# EAGLE design smd_2 (EAGLE 7.6.0)
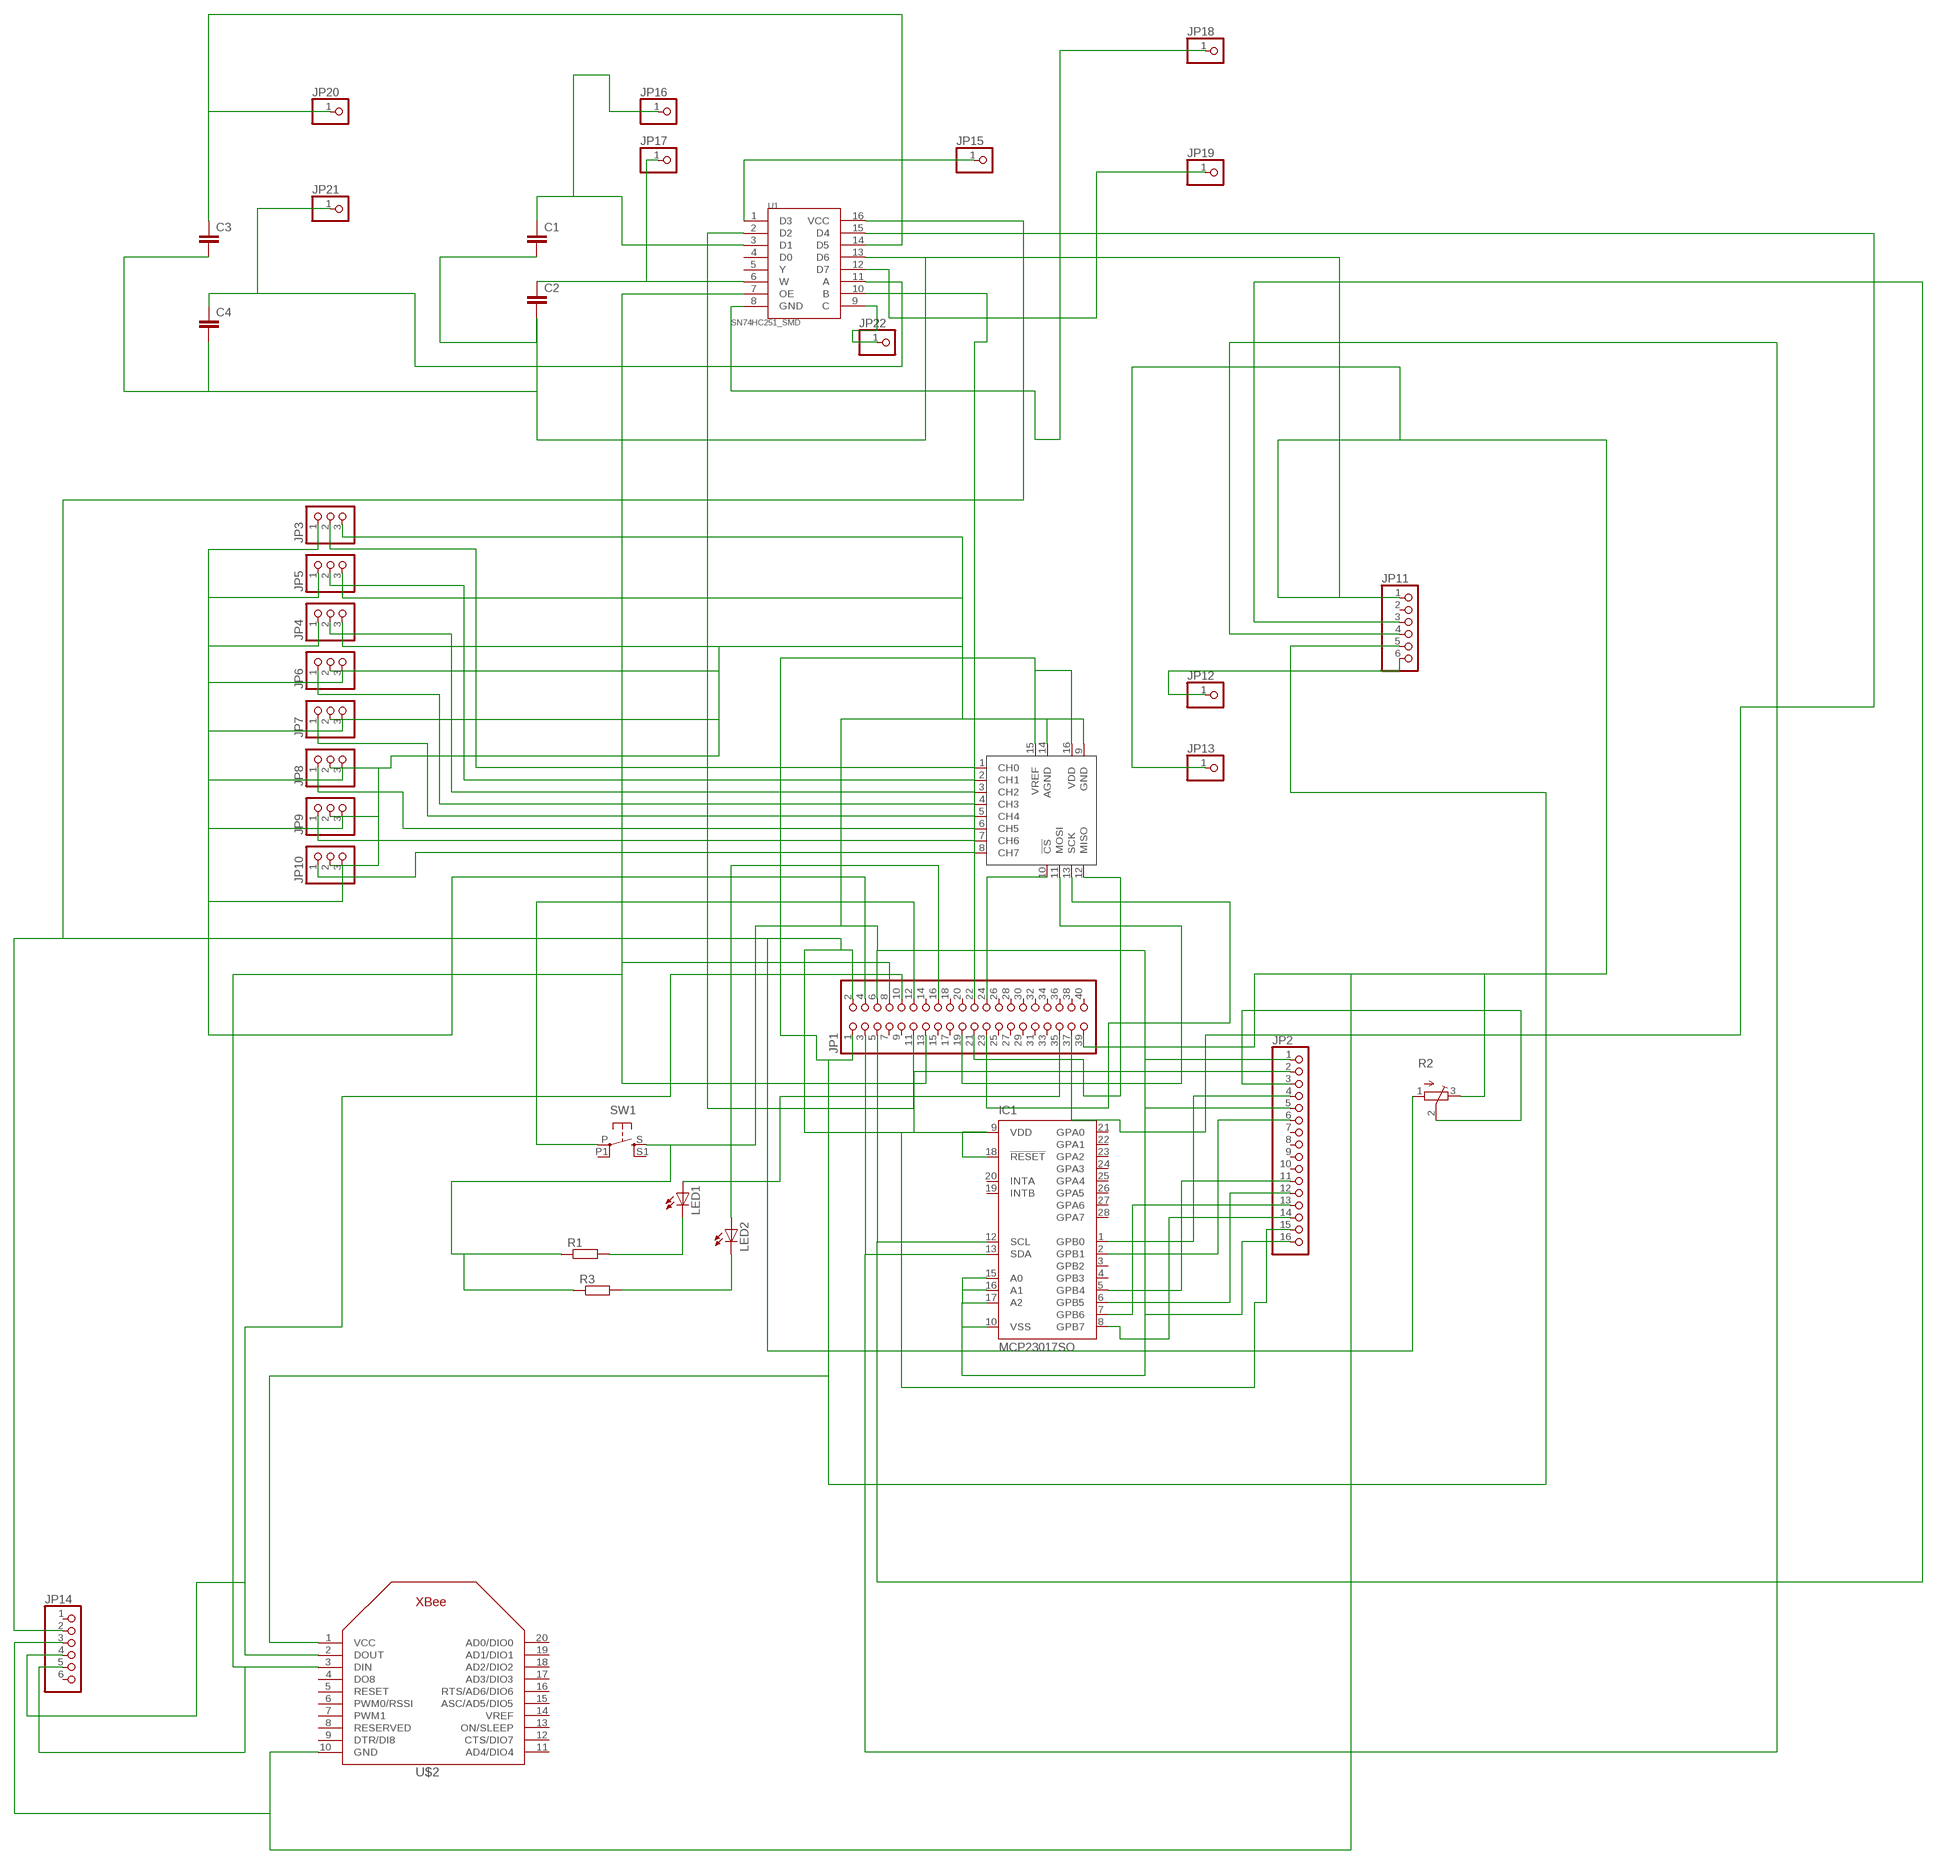
[diagram p0: schematic, sheet 1]

## Parts
C1  CAP1206  [1206]
C2  CAP1206  [1206]
C3  CAP1206  [1206]
C4  CAP1206  [1206]
IC1  MCP23017SO  [SO28W]
JP1  PINHD-2X20  [2X20]
JP2  PINHD-1X16  [1X16]
JP3  PINHD-1X3  [1X03]
JP4  PINHD-1X3  [1X03]
JP5  PINHD-1X3  [1X03]
JP6  PINHD-1X3  [1X03]
JP7  PINHD-1X3  [1X03]
JP8  PINHD-1X3  [1X03]
JP9  PINHD-1X3  [1X03]
JP10  PINHD-1X3  [1X03]
JP11  PINHD-1X6  [1X06]
JP12  PINHD-1X1  [1X01]
JP13  PINHD-1X1  [1X01]
JP14  PINHD-1X6  [1X06]
JP15  PINHD-1X1  [1X01]
JP16  PINHD-1X1  [1X01]
JP17  PINHD-1X1  [1X01]
JP18  PINHD-1X1  [1X01]
JP19  PINHD-1X1  [1X01]
JP20  PINHD-1X1  [1X01]
JP21  PINHD-1X1  [1X01]
JP22  PINHD-1X1  [1X01]
LED1  LEDSMT1206  [1206]
LED2  LEDCHIPLED_1206  [CHIPLED_1206]
R1  R-EU_M1206  [M1206]
R2  TRIM_EU-3223W  [3223W]
R3  R-EU_M1206  [M1206]
SW1  10-XX-4.5SMD  [BT4.5X4.5]
U1  SN74HC251_SMD  [SO016]
U$1  MCP3008SL  [SO16]
U$2  XBEE  [XBEE]

## Nets
GND: C1.2 C2.2 C3.2 C4.2 JP1.39 JP11.1 JP13.1 JP14.3 R2.3(E) U1.13(D6) U$2.10(GND)
N$1: IC1.10(VSS) IC1.15(A0) IC1.16(A1) IC1.17(A2) JP1.6 JP2.1 JP2.5 JP2.16 JP3.3 JP4.3 JP5.3 JP6.2 JP7.2 JP8.2 JP9.2 JP10.2 R1.1 R3.1 SW1.S U$1.9(GND) U$1.14(AGND)
N$2: IC1.9(VDD) IC1.18(!RESET) JP1.2 JP2.2 JP2.15 JP14.2 R2.1(A) U1.16(VCC)
N$3: JP1.12 SW1.P
N$4: IC1.12(SCL) JP1.5 JP11.3
N$5: IC1.13(SDA) JP1.3 JP11.4
N$6: IC1.1(GPB0) JP2.4
N$7: IC1.2(GPB1) JP2.6
N$8: LED1.C R1.2
N$9: JP1.35 LED1.A
N$10: IC1.8(GPB7) JP2.14
N$11: IC1.7(GPB6) JP2.13
N$12: IC1.6(GPB5) JP2.12
N$13: IC1.5(GPB4) JP2.11
N$14: JP1.10 JP14.4 U$2.2(DOUT)
N$15: JP1.24 U$1.10(!CS)
N$16: JP1.19 U$1.11(MOSI)
N$17: JP1.21 U$1.12(MISO)
N$18: JP1.23 U$1.13(SCK)
N$19: JP3.2 U$1.1(CH0)
N$20: JP5.2 U$1.2(CH1)
N$21: JP4.2 U$1.3(CH2)
N$22: JP6.1 U$1.4(CH3)
N$23: JP7.1 U$1.5(CH4)
N$24: JP8.1 U$1.6(CH5)
N$25: JP9.1 U$1.7(CH6)
N$26: JP10.1 U$1.8(CH7)
N$27: JP1.4 JP3.1 JP4.1 JP5.1 JP6.3 JP7.3 JP8.3 JP9.3 JP10.3
N$28: JP15.1 U1.1(D3)
N$29: JP11.6 JP12.1
N$30: JP1.8 JP14.5 U$2.3(DIN)
N$31: JP1.11 U1.2(D2)
N$32: JP1.13 U1.7(OE)
N$33: JP18.1 U1.8(GND)
N$34: C1.1 JP16.1 U1.3(D1)
N$35: C2.1 JP17.1 U1.6(W)
N$36: JP19.1 U1.12(D7)
N$37: JP2.3 R2.2(S)
N$38: JP1.16 LED2.A
N$39: LED2.C R3.2
N$40: C3.1 JP20.1 U1.14(D5)
N$41: C4.1 JP21.1 U1.11(A)
N$42: JP1.37 U1.15(D4)
N$43: JP1.22 U1.10(B)
N$44: JP22.1 U1.9(C)
VCC: JP1.1 JP11.5 U$1.15(VREF) U$1.16(VDD) U$2.1(VCC)
Unconnected: IC1.3(GPB2) IC1.4(GPB3) IC1.19(INTB) IC1.20(INTA) IC1.21(GPA0) IC1.22(GPA1) IC1.23(GPA2) IC1.24(GPA3) IC1.25(GPA4) IC1.26(GPA5) IC1.27(GPA6) IC1.28(GPA7) JP1.7 JP1.9 JP1.14 JP1.15 JP1.17 JP1.18 JP1.20 JP1.25 JP1.26 JP1.27 JP1.28 JP1.29 JP1.30 JP1.31 JP1.32 JP1.33 JP1.34 JP1.36 JP1.38 JP1.40 JP2.7 JP2.8 JP2.9 JP2.10 JP11.2 JP14.1 JP14.6 SW1.P1 SW1.S1 U1.4(D0) U1.5(Y) U$2.4(DO8) U$2.5(RESET) U$2.6(PWM0/RSSI) U$2.7(PWM1) U$2.8(RESERVED) U$2.9(DTR/DI8) U$2.11(AD4/DIO4) U$2.12(CTS/DIO7) U$2.13(ON/SLEEP) U$2.14(VREF) U$2.15(ASC/AD5/DIO5) U$2.16(RTS/AD6/DIO6) U$2.17(AD3/DIO3) U$2.18(AD2/DIO2) U$2.19(AD1/DIO1) U$2.20(AD0/DIO0)

## Library data of the parts
C1-C4 = SparkFun-Capacitors:CAP: Capacitor Standard 0603 ceramic capacitor, and 0.1" leaded capacitor.
IC1 = adafruit:MCP23017: http://ww1.microchip.com/downloads/en/DeviceDoc/21952a.pdf Source: http://ww1.microchip.com/downloads/en/DeviceDoc/21952a.pdf
JP1 = pinhead:PINHD-2X20: PIN HEADER
JP2 = pinhead:PINHD-1X16: PIN HEADER
JP3-JP10 = pinhead:PINHD-1X3: PIN HEADER
JP11 JP14 = pinhead:PINHD-1X6: PIN HEADER
JP12 JP13 JP15-JP22 = pinhead:PINHD-1X1: PIN HEADER
LED1 LED2 = led:LED: LED OSRAM: - CHIPLED LG R971, LG N971, LY N971, LG Q971, LY Q971, LO R971, LY R971 LH N974, LH R974 LS Q976, LO Q976, LY Q976 LO Q996 - Hyper CHIPLED LW Q18S LB Q993, LB Q99A, LB R99A - SideLED LS A670, LO A670, LY A670, LG A670, LP A670 LB A673, LV A673, LT A673, LW A673 LH A674 LY A675 LS A676, LA A676, LO A676, LY A676, LW A676 LS A679, LY A679, LG A679 - Hyper Micro SIDELED® LS Y876, LA Y876, LO Y876, LY Y876 LT Y87S - SmartLED LW L88C, LW L88S LB L89C, LB L89S, LG L890 LS L89K, LO L89K, LY L89K LS L896, LA L896, LO L896, LY L896 - TOPLED LS T670, LO T670, LY T670, LG T670, LP T670 LSG T670, LSP T670, LSY T670, LOP T670, LYG T670 LG T671, LOG T671, LSG T671 LB T673, LV T673, LT T673, LW T673 LH T674 LS T676, LA T676, LO T676, LY T676, LB T676, LH T676, LSB T676, LW T676 LB T67C, LV T67C, LT T67C, LS T67K, LO T67K, LY T67K, LW E67C LS E67B, LA E67B, LO E67B, LY E67B, LB E67C, LV E67C, LT E67C LW T67C LS T679, LY T679, LG T679 LS T770, LO T770, LY T770, LG T770, LP T770 LB T773, LV T773, LT T773, LW T773 LH T774 LS E675, LA E675, LY E675, LS T675 LS T776, LA T776, LO T776, LY T776, LB T776 LHGB T686 LT T68C, LB T68C - Hyper Mini TOPLED® LB M676 - Mini TOPLED Santana® LG M470 LS M47K, LO M47K, LY M47K Source: http://www.osram.convergy.de LUXEON: - LUMILED® LXK2-PW12-R00, LXK2-PW12-S00, LXK2-PW14-U00, LXK2-PW14-V00 LXK2-PM12-R00, LXK2-PM12-S00, LXK2-PM14-U00 LXK2-PE12-Q00, LXK2-PE12-R00, LXK2-PE12-S00, LXK2-PE14-T00, LXK2-PE14-U00 LXK2-PB12-K00, LXK2-PB12-L00, LXK2-PB12-M00, LXK2-PB14-N00, LXK2-PB14-P00, LXK2-PB14-Q00 LXK2-PR12-L00, LXK2-PR12-M00, LXK2-PR14-Q00, LXK2-PR14-R00 LXK2-PD12-Q00, LXK2-PD12-R00, LXK2-PD12-S00 LXK2-PH12-R00, LXK2-PH12-S00 LXK2-PL12-P00, LXK2-PL12-Q00, LXK2-PL12-R00 Source: www.luxeon.com KINGBRIGHT: KA-3528ASYC Source: www.kingbright.com
R1 R3 = resistor:R-EU_: RESISTOR, European symbol
R2 = pot:TRIM_EU-: POTENTIOMETER
SW1 = buttons:10-XX: OMRON SWITCH
U1 = SparkFun-DigitalIC:SN74HC251: SN54HC251 Data Selector/Multiplexer
U$1 = MCP3008:MCP3008
U$2 = adafruit:XBEE

## Board
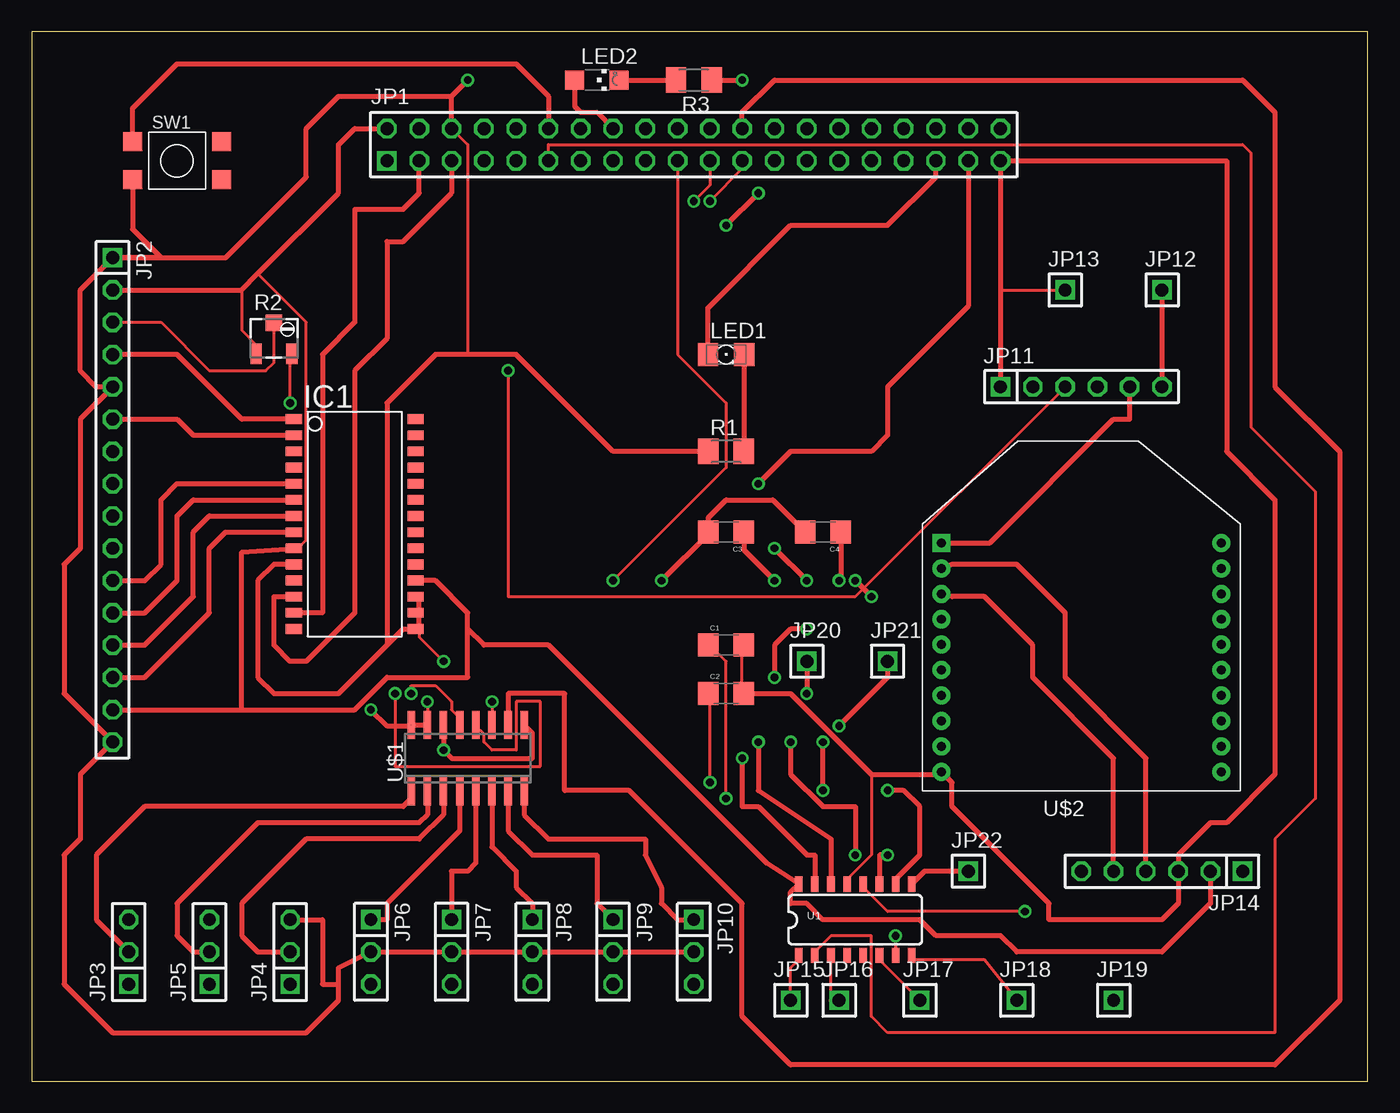
[diagram p1: board, top side]
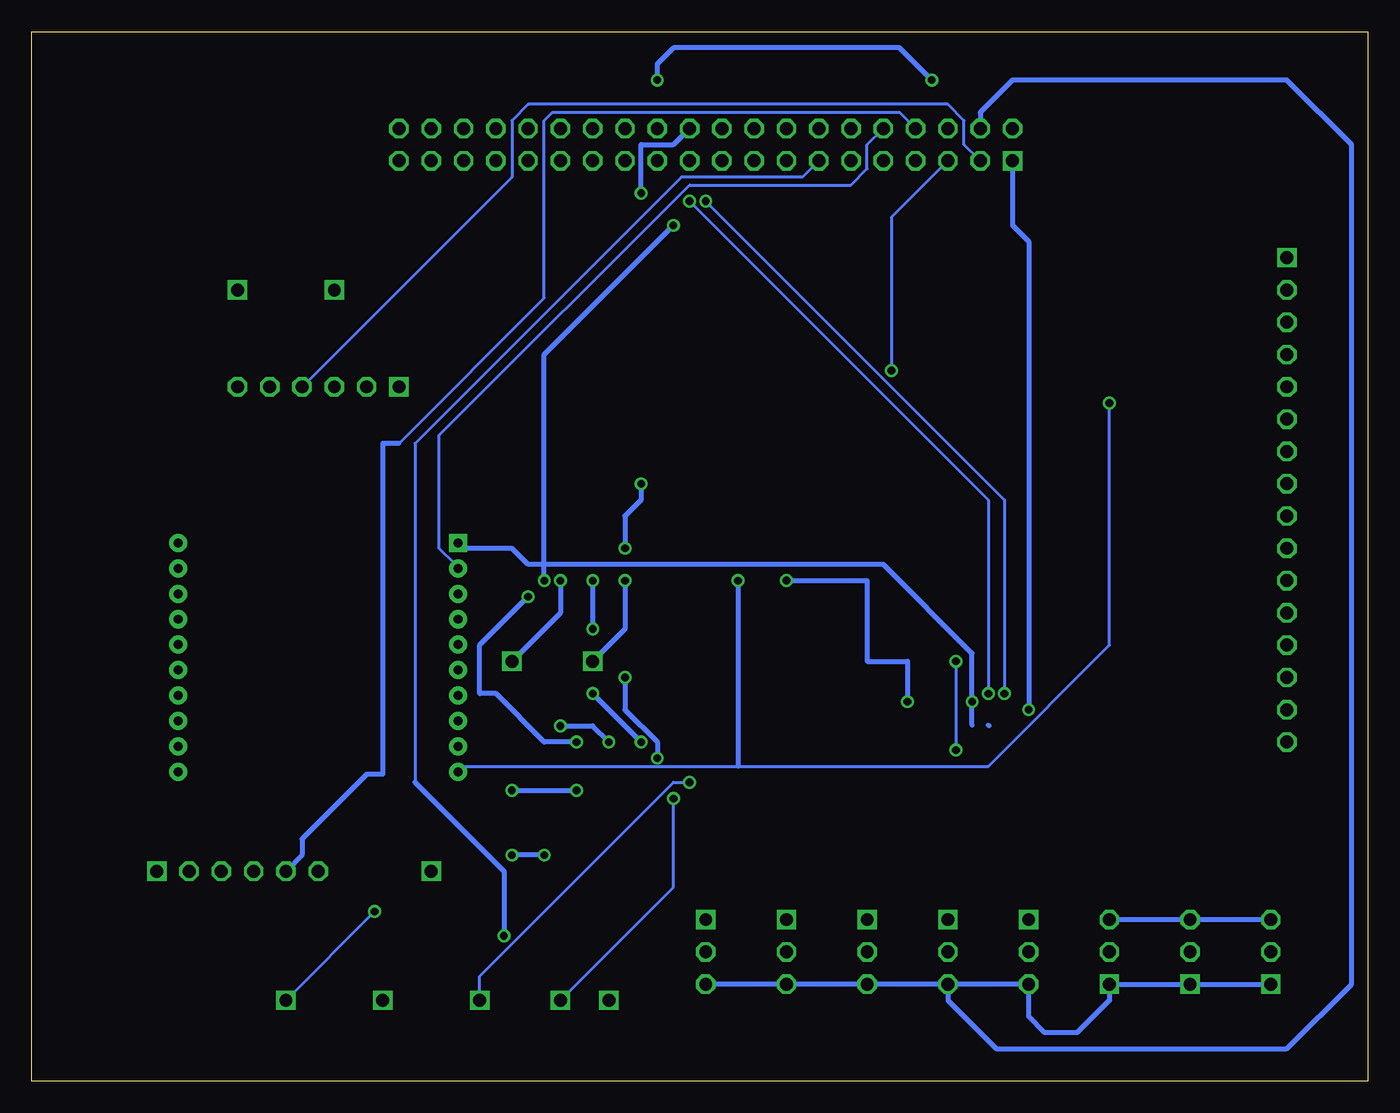
[diagram p2: board, bottom side, seen from below]

Size 105.08 x 82.54 mm. Coordinates in mm from the lower left corner, seen from the top.
Outline: 0,0 105.08,0 105.08,82.54 0,82.54 0,0
Copper layers (1*16): Top 0.035mm / dielectric 1.5mm / Bottom 0.035mm
Design rules "default": minimum track width 10mil, minimum drill 24mil, track to track 8mil, track to pad 8mil, pad to pad 8mil, via to via 8mil, smd to smd 8mil, copper to edge 40mil, drill to drill 8mil, minimum pad ring 10mil, minimum via ring 8mil, stop-mask expansion 4mil, vias tented up to drill 0mil, thermal gap 10mil

### Footprints (pad centres in the part's own frame; a part is rotated, then mirrored left to right if it is on the bottom)
1206 = smd 1.6 x 1.8: 1 -1.4,0; 2 1.4,0
SO28W = smd 0.762 x 1.27: 1 -7.62,-4.78; 2 -6.35,-4.78; 3 -5.08,-4.78; 4 -3.81,-4.78; 5 -2.54,-4.78; 6 -1.27,-4.78; 7 0,-4.78; 8 1.27,-4.78; 9 2.54,-4.78; 10 3.81,-4.78; 11 5.08,-4.78; 12 6.35,-4.78; 13 7.62,-4.78; 14 8.89,-4.78; 15 8.89,4.78; 16 7.62,4.78; 17 6.35,4.78; 18 5.08,4.78; 19 3.81,4.78; 20 2.54,4.78; 21 1.27,4.78; 22 0,4.78; 23 -1.27,4.78; 24 -2.54,4.78; 25 -3.81,4.78; 26 -5.08,4.78; 27 -6.35,4.78; 28 -7.62,4.78
2X20 = drill 1.016 square: 1 -24.13,-1.27 | drill 1.016 octagon: 2 -24.13,1.27; 3 -21.59,-1.27; 4 -21.59,1.27; 5 -19.05,-1.27; 6 -19.05,1.27; 7 -16.51,-1.27; 8 -16.51,1.27; 9 -13.97,-1.27; 10 -13.97,1.27; 11 -11.43,-1.27; 12 -11.43,1.27; 13 -8.89,-1.27; 14 -8.89,1.27; 15 -6.35,-1.27; 16 -6.35,1.27; 17 -3.81,-1.27; 18 -3.81,1.27; 19 -1.27,-1.27; 20 -1.27,1.27; 21 1.27,-1.27; 22 1.27,1.27; 23 3.81,-1.27; 24 3.81,1.27; 25 6.35,-1.27; 26 6.35,1.27; 27 8.89,-1.27; 28 8.89,1.27; 29 11.43,-1.27; 30 11.43,1.27; 31 13.97,-1.27; 32 13.97,1.27; 33 16.51,-1.27; 34 16.51,1.27; 35 19.05,-1.27; 36 19.05,1.27; 37 21.59,-1.27; 38 21.59,1.27; 39 24.13,-1.27; 40 24.13,1.27
1X16 = drill 1.016 square: 1 -19.05,0 | drill 1.016 octagon: 2 -16.51,0; 3 -13.97,0; 4 -11.43,0; 5 -8.89,0; 6 -6.35,0; 7 -3.81,0; 8 -1.27,0; 9 1.27,0; 10 3.81,0; 11 6.35,0; 12 8.89,0; 13 11.43,0; 14 13.97,0; 15 16.51,0; 16 19.05,0
1X03 = drill 1.016 square: 1 -2.54,0 | drill 1.016 octagon: 2 0,0; 3 2.54,0
1X06 = drill 1.016 square: 1 -6.35,0 | drill 1.016 octagon: 2 -3.81,0; 3 -1.27,0; 4 1.27,0; 5 3.81,0; 6 6.35,0
1X01 = drill 1.016 square: 1 0,0
1206' = smd 1.6 x 1.803: A -1.422,0; C 1.422,0
CHIPLED_1206 = smd 1.5 x 1.5: A 0,-1.75; C 0,1.75
M1206 = smd 1.6 x 2: 1 -1.4,0; 2 1.4,0
3223W = smd 0.9 x 1.6: 1 -1.4,-1.215; 3 1.4,-1.215 | smd 1.3 x 1.3: 2 0,1.215
BT4.5X4.5 = smd 1.5 x 1.5: P -3.5,1.5; P1 3.5,1.5; S -3.5,-1.5; S1 3.5,-1.5
SO016 = smd 0.6 x 1.2: 1 -4.445,-2.8; 2 -3.175,-2.8; 3 -1.905,-2.8; 4 -0.635,-2.8; 5 0.635,-2.8; 6 1.905,-2.8; 7 3.175,-2.8; 8 4.445,-2.8; 9 4.445,2.8; 10 3.175,2.8; 11 1.905,2.8; 12 0.635,2.8; 13 -0.635,2.8; 14 -1.905,2.8; 15 -3.175,2.8; 16 -4.445,2.8
SO16 = smd 0.6 x 2.2: 1 -4.445,-2.6; 2 -3.175,-2.6; 3 -1.905,-2.6; 4 -0.635,-2.6; 5 0.635,-2.6; 6 1.905,-2.6; 7 3.175,-2.6; 8 4.445,-2.6; 9 4.445,2.6; 10 3.175,2.6; 11 1.905,2.6; 12 0.635,2.6; 13 -0.635,2.6; 14 -1.905,2.6; 15 -3.175,2.6; 16 -4.445,2.6
XBEE = drill 0.7 pad 1.422 square: 1 -11,5.5 | drill 0.7 pad 1.422: 2 -11,3.5; 3 -11,1.5; 4 -11,-0.5; 5 -11,-2.5; 6 -11,-4.5; 7 -11,-6.5; 8 -11,-8.5; 9 -11,-10.5; 10 -11,-12.5; 11 11,-12.5; 12 11,-10.5; 13 11,-8.5; 14 11,-6.5; 15 11,-4.5; 16 11,-2.5; 17 11,-0.5; 18 11,1.5; 19 11,3.5; 20 11,5.5

### Placement (x,y rotation side)
C1  54.61,34.29 0 top
C2  54.61,30.48 0 top
C3  54.61,43.18 180 top
C4  62.23,43.18 180 top
IC1  25.4,44.45 270 top
JP1  52.07,73.66 0 top
JP2  6.35,45.72 270 top
JP3  7.62,10.16 90 top
JP4  20.32,10.16 90 top
JP5  13.97,10.16 90 top
JP6  26.67,10.16 270 top
JP7  33.02,10.16 270 top
JP8  39.37,10.16 270 top
JP9  45.72,10.16 270 top
JP10  52.07,10.16 270 top
JP11  82.55,54.61 0 top
JP12  88.9,62.23 0 top
JP13  81.28,62.23 0 top
JP14  88.9,16.51 180 top
JP15  59.69,6.35 0 top
JP16  63.5,6.35 0 top
JP17  69.85,6.35 0 top
JP18  77.47,6.35 0 top
JP19  85.09,6.35 0 top
JP20  60.96,33.02 0 top
JP21  67.31,33.02 0 top
JP22  73.66,16.51 0 top
LED1  [1206']  54.61,57.15 0 top
LED2  44.45,78.74 270 top
R1  54.61,49.53 0 top
R2  19.05,58.42 0 top
R3  52.07,78.74 180 top
SW1  11.43,72.39 0 top
U1  64.77,12.7 0 top
U$1  34.29,25.4 0 top
U$2  82.55,36.83 0 top

### Tracks (layer width: path | path; a pad name or v marks a point on that pad's centre or on a via)
GND  (via drill 0.6, 0.61)
  Top 0.254: 66.04,24.13 66.04,17.78 64.14,15.88 U1.13 | v20.32,53.34 20.32,57.15 R2.3 | C1.2 55.88,34.29 55.88,30.48 C2.2 | 76.2,62.23 JP13.1
  Top 0.406: JP11.1 76.2,62.23 JP1.39 93.98,72.39 93.98,49.53 97.79,45.72 97.79,24.13 93.98,20.32 92.71,20.32 90.17,17.78 JP14.3 90.17,13.97 88.9,12.7 80.01,12.7 80.01,13.97 72.39,21.59 72.39,23.49 U$2.10 71.35,24.13 66.04,24.13 59.69,30.48 C2.2 | v49.53,39.37 53.21,43.05 C3.2 53.21,44.32 54.61,45.72 58.29,45.72 C4.2
  Bottom 0.254: v20.32,53.34 20.32,34.29 29.84,24.77 49.53,24.77 71.12,24.77 U$2.10
  Bottom 0.406: v49.53,39.37 49.53,24.77
N$1  (via drill 0.6, 0.61)
  Top 0.254: 30.48,36.83 IC1.16 | 34.29,57.15 34.29,73.66 JP1.6 | v32.38,33.02 30.48,34.92 30.48,35.56
  Top 0.406: SW1.S 7.93,67 10.16,64.77 JP2.1 | JP2.1 15.24,64.77 21.59,71.12 21.59,74.93 24.13,77.47 33.02,77.47 | 24.13,7.62 24.13,6.35 21.59,3.81 6.35,3.81 2.54,7.62 2.54,17.78 3.81,19.05 3.81,24.13 JP2.16 2.54,30.48 2.54,40.64 3.81,41.91 3.81,52.07 JP2.5 5.08,54.61 3.81,55.88 3.81,62.23 JP2.1 | 24.13,7.62 24.13,8.89 JP6.2 JP7.2 JP8.2 JP9.2 JP10.2 | JP4.3 22.86,12.7 22.86,7.62 24.13,7.62 | IC1.10 19.05,40.64 17.78,39.37 17.78,31.75 19.05,30.48 24.13,30.48 27.94,34.29 | 27.94,34.29 29.21,35.56 IC1.15 30.48,35.56 30.48,36.83 30.48,37.8 IC1.17 | U$1.14 v32.38,26.03 33.02,25.4 39.37,25.4 39.37,27.37 U$1.9 | R1.1 45.72,49.53 38.1,57.15 34.29,57.15 31.75,57.15 27.94,53.34 27.94,34.29 | 33.02,77.47 v34.29,78.74 | JP1.6 33.02,77.47 | R3.1 v55.88,78.74
  Bottom 0.254: v32.38,33.02 v32.38,26.03
  Bottom 0.406: JP3.3 JP5.3 JP4.3 | v34.29,78.74 36.83,81.28 54.61,81.28 55.88,80.01 v55.88,78.74
N$2
  Top 0.254: 16.51,62.23 16.51,59.05 17.78,57.78 R2.1 | 17.78,63.5 21.59,59.69 21.59,42.55 20.95,41.91 IC1.9
  Top 0.406: 16.51,29.21 16.51,41.61 IC1.9 | JP2.15 16.51,29.21 | 16.51,29.21 25.4,29.21 27.94,31.75 34.29,31.75 34.29,35.56 | 34.29,35.56 34.29,36.83 31.75,39.37 IC1.18 | 34.29,35.56 35.56,34.29 40.64,34.29 57.79,17.14 U1.16 59.69,14.87 59.69,13.97 60.96,13.97 62.23,12.7 69.85,12.7 71.12,11.43 76.2,11.43 77.47,10.16 88.9,10.16 92.71,13.97 JP14.2 | JP2.2 16.51,62.23 17.78,63.5 24.13,69.85 24.13,73.66 25.4,74.93 JP1.2
N$3
  Top 0.406: SW1.P 7.93,76.51 11.43,80.01 38.1,80.01 40.64,77.47 JP1.12
N$4  (via drill 0.61)
  Top 0.254: JP11.3 64.77,38.1 37.47,38.1 v37.47,55.88
  Top 0.406: JP1.5 33.02,69.85 29.21,66.04 27.94,66.04 27.94,58.42 25.4,55.88 25.4,36.83 21.59,33.02 20.32,33.02 19.05,34.29 19.05,38.1 IC1.12
  Bottom 0.254: v37.47,55.88 37.47,67.95 JP1.5
N$5
  Top 0.406: IC1.13 22.86,36.83 22.86,57.15 25.4,59.69 25.4,68.58 29.21,68.58 30.48,69.85 JP1.3
  Bottom 0.254: JP11.4 67.31,71.12 67.31,75.56 66.04,76.83 33.02,76.83 31.75,75.56 31.75,73.66 JP1.3
N$6
  Top 0.406: IC1.1 16.51,52.07 11.43,57.15 JP2.4
N$7
  Top 0.406: JP2.6 11.43,52.07 12.7,50.8 IC1.2
N$8
  Top 0.406: LED1.C 56.03,49.55 R1.2
N$9
  Top 0.406: LED1.A 53.19,60.81 59.69,67.31 67.31,67.31 71.12,71.12 JP1.35
N$10
  Top 0.406: JP2.14 8.89,31.75 13.97,36.83 13.97,41.91 15.24,43.18 IC1.8
N$11
  Top 0.406: JP2.13 8.89,34.29 12.7,38.1 12.7,43.18 13.97,44.45 IC1.7
N$12
  Top 0.406: JP2.12 8.89,36.83 11.43,39.37 11.43,44.45 12.7,45.72 IC1.6
N$13
  Top 0.406: JP2.11 8.89,39.37 10.16,40.64 10.16,45.72 11.43,46.99 IC1.5
N$14
  Top 0.406: JP14.4 87.63,25.4 81.28,31.75 81.28,36.83 77.47,40.64 72.39,40.64 U$2.2
  Bottom 0.254: JP1.10 39.37,73.66 39.37,71.75 40.64,70.48 53.34,70.48 73.02,50.8 73.02,41.91 71.75,40.64 U$2.2
N$15
  Top 0.406: JP1.24 55.88,76.2 58.42,78.74 95.25,78.74 97.79,76.2 97.79,54.61 102.87,49.53 102.87,6.35 97.79,1.27 59.69,1.27 55.88,5.08 55.88,13.97 46.99,22.86 41.91,22.86 41.91,30.48 37.47,30.48 U$1.10
N$16  (via drill 0.61)
  Top 0.254: v36.2,29.84 U$1.11 | v45.72,39.37 54.61,48.26 54.61,53.34 50.8,57.15 JP1.19
  Bottom 0.406: v45.72,39.37 39.37,39.37 39.37,33.02 36.2,33.02 v36.2,29.84
N$17  (via drill 0.61)
  Top 0.254: v28.57,30.48 28.57,24.77 40.01,24.77 40.01,29.84 38.1,29.84 38.1,26.03 36.2,26.03 35.56,26.67 35.56,27.3 34.93,27.94 U$1.12 | v52.07,69.22 53.34,70.48 JP1.21
  Bottom 0.254: v28.57,30.48 28.57,45.72 v52.07,69.22
N$18  (via drill 0.61)
  Top 0.254: v29.84,30.48 29.84,31.12 31.75,31.12 33.02,29.84 33.02,29.21 33.66,28.58 U$1.13 | v53.34,69.22 55.88,71.75 JP1.23
  Bottom 0.254: v29.84,30.48 29.84,45.72 v53.34,69.22
N$19
  Top 0.406: U$1.1 29.84,22.23 29.21,21.59 8.89,21.59 5.08,17.78 5.08,12.7 JP3.2
N$20
  Top 0.406: U$1.2 31.11,20.95 30.48,20.32 17.78,20.32 11.43,13.97 11.43,11.43 12.7,10.16 JP5.2
N$21
  Top 0.406: U$1.3 32.38,20.95 30.48,19.05 21.59,19.05 16.51,13.97 16.51,11.43 17.78,10.16 JP4.2
N$22
  Top 0.406: U$1.4 33.66,19.69 27.94,13.97 27.94,12.7 JP6.1
N$23
  Top 0.406: U$1.5 34.93,17.14 34.29,16.51 33.02,16.51 JP7.1
N$24
  Top 0.406: U$1.6 36.2,18.41 38.1,16.51 38.1,15.24 39.37,13.97 JP8.1
N$25
  Top 0.406: U$1.7 37.47,19.69 39.37,17.78 44.45,17.78 44.45,13.97 JP9.1
N$26
  Top 0.406: U$1.8 38.74,20.95 40.64,19.05 48.26,19.05 48.26,17.78 49.53,15.24 49.53,13.97 50.8,12.7 JP10.1
N$27
  Bottom 0.406: JP3.1 JP5.1 JP4.1 20.32,6.35 22.86,3.81 25.4,3.81 26.67,5.08 JP6.3 JP7.3 | JP7.3 JP8.3 JP9.3 JP10.3 | JP7.3 33.02,6.35 29.21,2.54 6.35,2.54 1.27,7.62 1.27,73.66 6.35,78.74 27.94,78.74 30.48,76.2 JP1.4
N$28
  Top 0.254: JP15.1 59.69,8.89 60.33,9.53 U1.1
N$29
  Top 0.406: JP12.1 JP11.6
N$30
  Top 0.406: JP14.5 85.09,25.4 78.74,31.75 78.74,34.29 74.93,38.1 72.39,38.1 U$2.3
  Bottom 0.254: JP1.8 36.83,76.2 64.14,76.2 64.77,75.56 64.77,61.59 76.2,50.16
  Bottom 0.406: 76.2,50.16 77.47,50.16 77.47,24.13 78.74,24.13 83.82,19.05 83.82,17.78 JP14.5
N$31
  Top 0.254: JP1.11 40.64,73.66 95.25,73.66 95.88,73.02 95.88,51.43 100.96,46.35 100.96,22.23 97.79,19.05 97.79,3.81 67.31,3.81 66.04,5.08 66.04,11.43 62.87,11.43 61.6,10.16 U1.2
N$32  (via drill 0.61)
  Top 0.254: v67.94,11.43 U1.7
  Bottom 0.254: 74.93,23.49 74.93,50.16 53.98,71.12 44.45,71.12 JP1.13
  Bottom 0.406: v67.94,11.43 67.94,16.51 74.93,23.49
N$33
  Top 0.254: JP18.1 74.93,9.53 69.21,9.53 U1.8
N$34  (via drill 0.61)
  Top 0.254: 62.87,6.35 U1.3 | v54.61,22.23 54.61,33.02 53.34,34.29 C1.1
  Top 0.406: JP16.1 62.87,6.35
  Bottom 0.254: v54.61,22.23 54.61,15.24 JP16.1
N$35  (via drill 0.61)
  Top 0.254: JP17.1 66.67,9.53 U1.6 | v53.34,23.49 53.34,30.48 C2.1
  Bottom 0.254: v53.34,23.49 54.61,23.49 69.85,8.25 JP17.1
N$36  (via drill 0.61)
  Top 0.254: v78.1,13.34 67.31,13.34 65.41,15.24 U1.12
  Bottom 0.254: JP19.1 v78.1,13.34
N$37
  Top 0.254: R2.2 19.05,56.52 18.41,55.88 13.97,55.88 10.16,59.69 JP2.3
N$38
  Top 0.406: LED2.A 42.7,76.68 43.18,76.2 44.45,76.2 JP1.16
N$39
  Top 0.406: LED2.C R3.2
N$40  (via drill 0.6)
  Top 0.406: C3.1 56.01,41.78 v58.42,39.37 | JP20.1 v60.96,30.48 | v57.15,26.67 57.15,22.86 62.87,19.05 U1.14
  Bottom 0.406: v58.42,39.37 58.42,35.56 JP20.1 | v60.96,30.48 v57.15,26.67
N$41  (via drill 0.6)
  Top 0.406: C4.1 63.63,39.5 v63.5,39.37 | JP21.1 67.31,31.75 v63.5,27.94 | v59.69,26.67 59.69,24.13 62.23,21.59 64.77,21.59 v64.77,17.78 | v67.31,17.78 66.67,17.78 U1.11
  Bottom 0.406: v63.5,39.37 63.5,36.83 JP21.1 | v63.5,27.94 60.96,27.94 v59.69,26.67 | v64.77,17.78 v67.31,17.78
N$42  (via drill 0.6)
  Top 0.406: JP1.37 73.66,60.96 67.31,54.61 67.31,50.8 66.04,49.53 59.69,49.53 v57.15,46.99 | v58.42,41.91 v60.96,39.37 | v60.96,35.56 59.69,35.56 58.42,34.29 v58.42,31.75 | v55.88,25.4 55.88,21.59 57.15,21.59 60.96,17.78 61.6,17.78 U1.15
  Bottom 0.406: v57.15,46.99 57.15,45.72 58.42,44.45 v58.42,41.91 | v60.96,39.37 v60.96,35.56 | v58.42,31.75 58.42,29.21 55.88,26.67 v55.88,25.4
N$43  (via drill 0.6)
  Top 0.406: U1.10 67.94,15.88 69.85,17.78 69.85,21.59 68.58,22.86 v67.31,22.86 | v62.23,22.86 v62.23,26.67 | v66.04,38.1 v64.77,39.37 | v54.61,67.31 v57.15,69.85
  Bottom 0.406: v67.31,22.86 v62.23,22.86 | v62.23,26.67 64.77,26.67 68.58,30.48 69.85,30.48 69.85,34.29 v66.04,38.1 | v64.77,39.37 64.77,57.15 v54.61,67.31 | v57.15,69.85 57.15,73.66 54.61,73.66 JP1.22
N$44
  Top 0.406: JP22.1 70.22,16.51 U1.9
VCC  (via drill 0.6, 0.61)  (1 unrouted)
  Top 0.254: 29.84,27.94 U$1.16 | 31.11,27.94 U$1.15 v31.11,29.84
  Top 0.406: U$2.1 75.35,42.33 85.09,52.07 86.36,52.07 JP11.5 | v26.67,29.21 27.94,27.94 29.79,27.94 U$1.16 U$1.15
  Bottom 0.406: JP1.1 27.94,67.31 26.67,66.04 v26.67,29.21 | 29.79,27.94 U$1.16 | U$1.15 v31.11,29.84 31.11,33.66 38.1,40.64 66.04,40.64 67.31,41.91 71.13,41.91 U$2.1